# EAGLE design LaserCutterControlSimple (EAGLE 7.1.0)
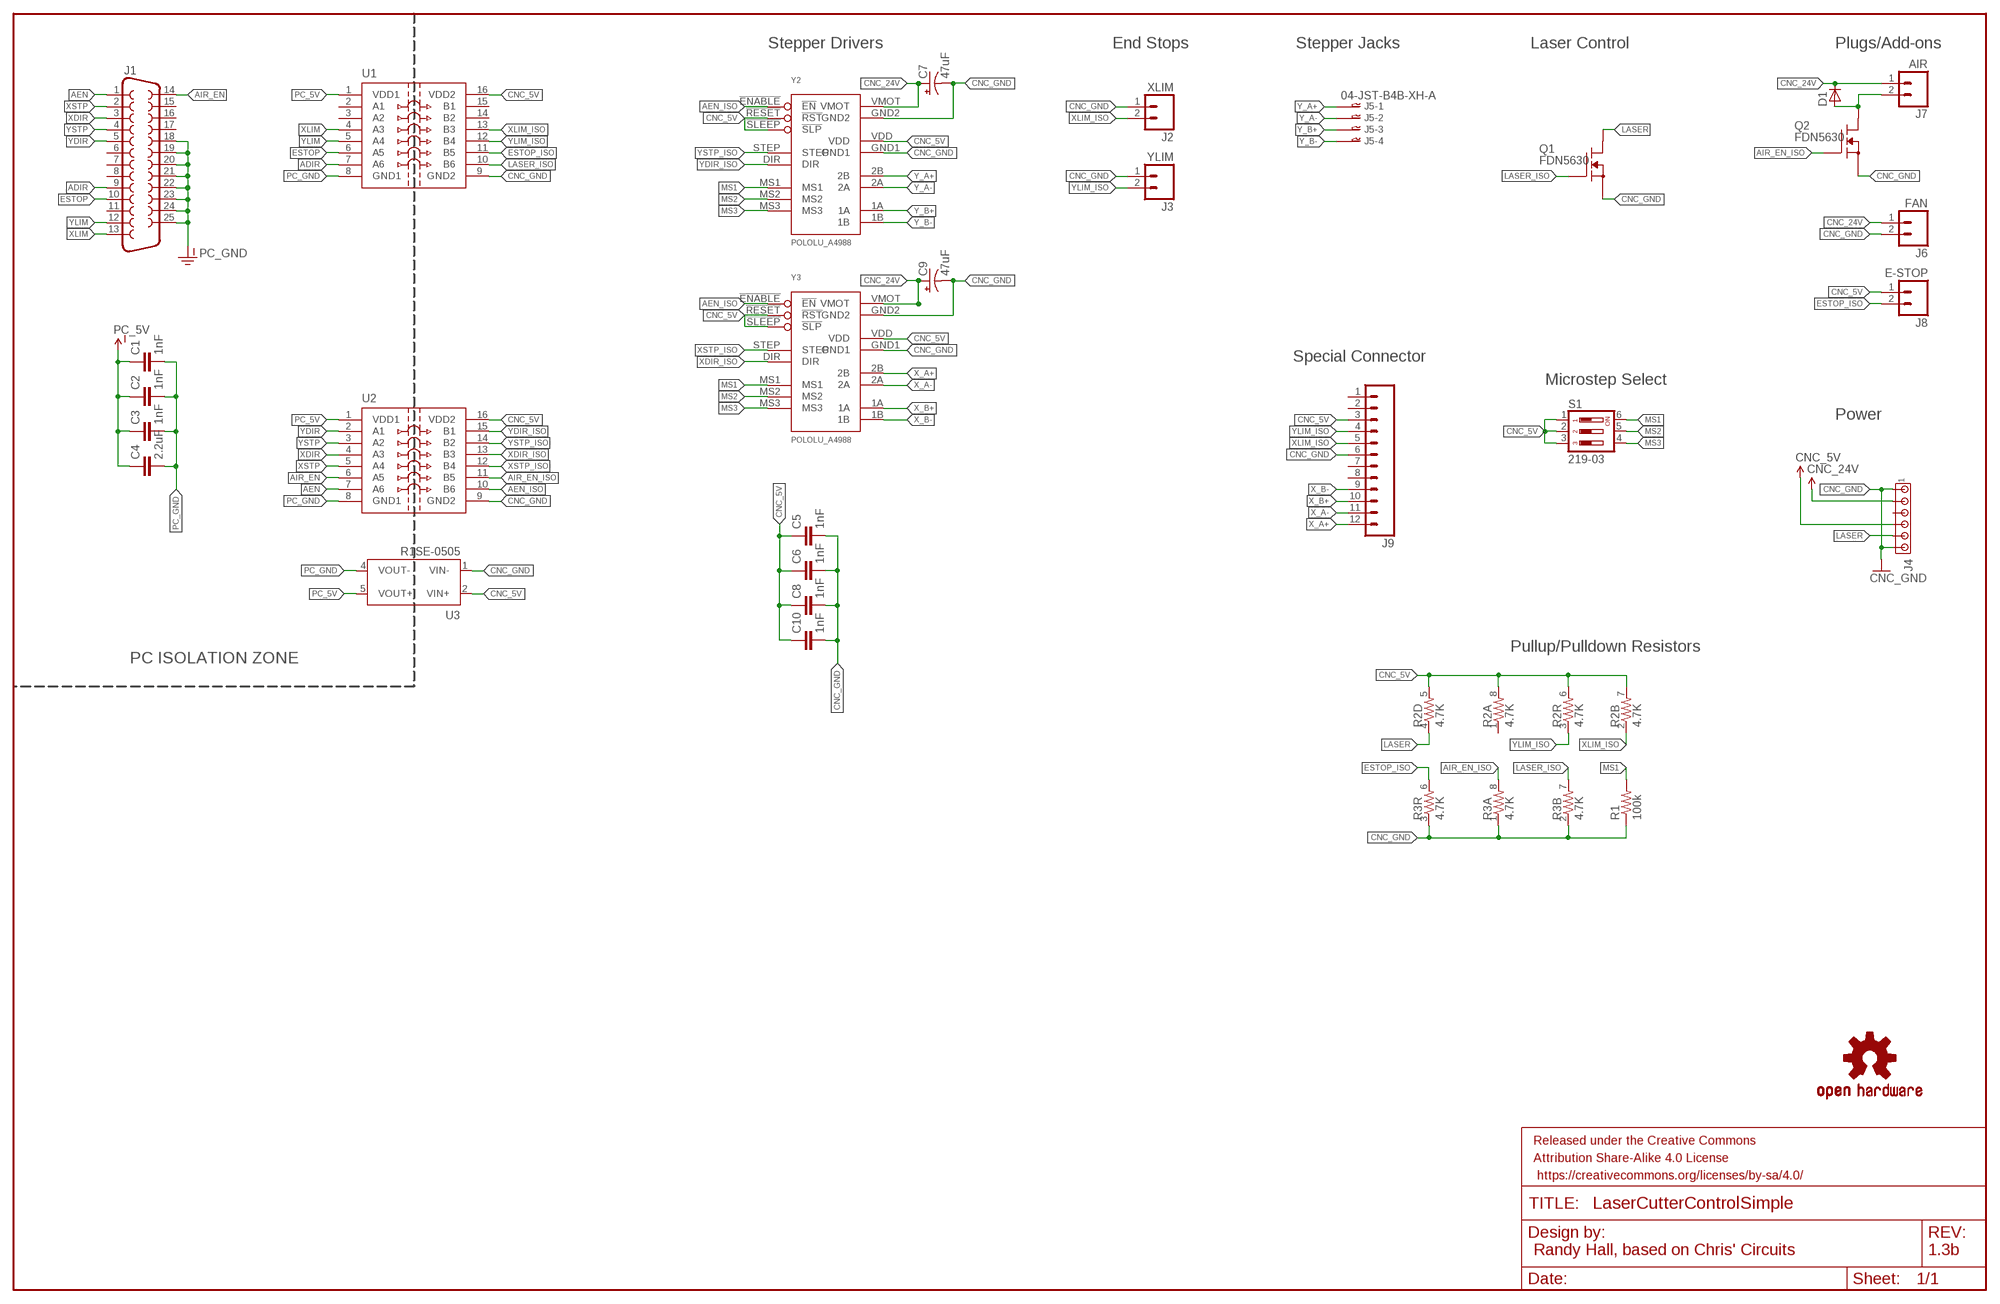
[diagram p0: schematic, sheet 1]

## Parts
C1  1nF  1NF/1000PF-50V-10%(0603)  [0603-CAP]
C2  1nF  1NF/1000PF-50V-10%(0603)  [0603-CAP]
C3  1nF  1NF/1000PF-50V-10%(0603)  [0603-CAP]
C4  2.2uF  1NF/1000PF-50V-10%(0603)  [0603-CAP]
C5  1nF  1NF/1000PF-50V-10%(0603)  [0603-CAP]
C6  1nF  1NF/1000PF-50V-10%(0603)  [0603-CAP]
C7  47uF  CPOL-USE  [PANASONIC_E]
C8  1nF  1NF/1000PF-50V-10%(0603)  [0603-CAP]
C9  47uF  CPOL-USE  [PANASONIC_E]
C10  1nF  1NF/1000PF-50V-10%(0603)  [0603-CAP]
D1  D-SOD123  [SOD123]
FRAME1  FRAME-LEDGER  [CREATIVE_COMMONS]
J1  F25HP  [F25HP]
J2  XLIM  M02PTH  [1X02]
J3  YLIM  M02PTH  [1X02]
J4  MTA06-156  [1X6MTA]
J5  04-JST-B4B-XH-A  [B4B-XH]
J6  FAN  M02PTH  [1X02]
J7  AIR  M02PTH  [1X02]
J8  E-STOP  M02PTH  [1X02]
J9  M12  [12P]
LOGO1  OSHW-LOGOM  [OSHW-LOGO-M]
Q1  FDN5630  [SOT23]
Q2  FDN5630  [SOT23]
R1  100k  100KOHM1/10W1%(0603)  [0603-RES]
R2  4.7K  RESISTOR-ARRAY0603-ARV  [0603-ARV]
R3  4.7K  RESISTOR-ARRAY0603-ARV  [0603-ARV]
S1  219-03  [CTS-219-03]
U1  SI8460IS1  [SO16]
U2  SI8460IS1  [SO16]
U3  R1SE-0505  [SMD5]
Y2  POLOLU_A4988  [POLOLU_STEPPER_DRIVER]
Y3  POLOLU_A4988  [POLOLU_STEPPER_DRIVER]

## Nets
ADIR: J1.9 U1.7(A6)
AEN: J1.1 U2.7(A6)
AEN_ISO: U2.10(B6) Y2.!ENABLE(!EN) Y3.!ENABLE(!EN)
AIR_EN: J1.14 U2.6(A5)
AIR_EN_ISO: Q2.1(G) R3.8 U2.11(B5)
CNC_5V: C5.1 C6.1 C8.1 C10.1 J4.4 J8.1 J9.3 R2.5 R2.6 R2.7 R2.8 S1.1 S1.2 S1.3 U1.16(VDD2) U2.16(VDD2) U3.2(VIN+) Y2.!RESET(!RST) Y2.!SLEEP(!SLP) Y2.VDD Y3.!RESET(!RST) Y3.!SLEEP(!SLP) Y3.VDD
CNC_24V: C7.+ C9.+ D1.1(C) J4.2 J6.1 J7.1 Y2.VMOT Y3.VMOT
CNC_GND: C5.2 C6.2 C7.- C8.2 C9.- C10.2 J2.1 J3.1 J4.1 J4.6 J6.2 J9.6 Q1.2(S) Q2.2(S) R1.1 R3.1 R3.2 R3.3 U1.9(GND2) U2.9(GND2) U3.1(VIN-) Y2.GND1 Y2.GND2 Y3.GND1 Y3.GND2
ESTOP: J1.10 U1.6(A5)
ESTOP_ISO: J8.2 R3.6 U1.11(B5)
LASER: J4.5 Q1.3(D) R2.4
LASER_ISO: Q1.1(G) R3.7 U1.10(B6)
MS1: R1.2 S1.6 Y2.MS1 Y3.MS1
MS2: S1.5 Y2.MS2 Y3.MS2
MS3: S1.4 Y2.MS3 Y3.MS3
N$8: D1.2(A) J7.2 Q2.3(D)
PC_5V: C1.1 C2.1 C3.1 C4.1 U1.1(VDD1) U2.1(VDD1) U3.5(VOUT+)
PC_GND: C1.2 C2.2 C3.2 C4.2 J1.18 J1.19 J1.20 J1.21 J1.22 J1.23 J1.24 J1.25 U1.8(GND1) U2.8(GND1) U3.4(VOUT-)
X_A+: J9.12 Y3.2B
X_A-: J9.11 Y3.2A
X_B+: J9.10 Y3.1A
X_B-: J9.9 Y3.1B
XDIR: J1.3 U2.4(A3)
XDIR_ISO: U2.13(B3) Y3.DIR
XLIM: J1.13 U1.4(A3)
XLIM_ISO: J2.2 J9.5 R2.2 U1.13(B3)
XSTP: J1.2 U2.5(A4)
XSTP_ISO: U2.12(B4) Y3.STEP
Y_A+: J5.P$1 Y2.2B
Y_A-: J5.P$2 Y2.2A
Y_B+: J5.P$3 Y2.1A
Y_B-: J5.P$4 Y2.1B
YDIR: J1.5 U2.2(A1)
YDIR_ISO: U2.15(B1) Y2.DIR
YLIM: J1.12 U1.5(A4)
YLIM_ISO: J3.2 J9.4 R2.3 U1.12(B4)
YSTP: J1.4 U2.3(A2)
YSTP_ISO: U2.14(B2) Y2.STEP
Unconnected: J1.6 J1.7 J1.8 J1.11 J1.15 J1.16 J1.17 J4.3 J9.1 J9.2 J9.7 J9.8 R2.1 R3.4 R3.5 U1.2(A1) U1.3(A2) U1.14(B2) U1.15(B1)

## Notes on the sheet
- Stepper Drivers | End Stops | Stepper Jacks | Laser Control | Plugs/Add-ons
- Special Connector
- Microstep Select
- Power
- Pullup/Pulldown Resistors
- PC ISOLATION ZONE
- Randy Hall, based on Chris' Circuits | 1.3b

## Library data of the parts
C1-C3 C5 C6 C8 C10 = SparkFun-Capacitors:1NF/1000PF-50V-10%(0603): CAP-07886; PROD_ID: CAP-07886
C4 = SparkFun-Capacitors:1NF/1000PF-50V-10%(0603): CAP-07886; PROD_ID: CAP-07886; VALUE: 1nF
C7 C9 = rcl:CPOL-US: POLARIZED CAPACITOR, American symbol
D1 = semicon-smd-ipc:D-: DIODE unfilled
FRAME1 = SparkFun-Aesthetics:FRAME-LEDGER: Schematic Frame Standard 11x14 US Ledger frame
J1 = SparkFun-Connectors:F25: 25 Pin male connector. PCB edge mount for regular PCB thicknesses. This connector will connect directly to the back of a PC parallel port or through a normal DB25 extension cable (M/F). SKU: PRT-08287
J2 J3 J6-J8 = SparkFun-Connectors:M02: Standard 2-pin 0.1" header. Use with - straight break away headers ( PRT-00116) - right angle break away headers (PRT-00553) - swiss pins (PRT-00743) - machine pins (PRT-00117) - female headers (PRT-00115) Molex polarized connector foot print use with: PRT-08233 with associated crimp pins and housings. 2.54_SCREWTERM for use with PRT-10571. 3.5mm Screw Terminal footprints for PRT-08084 5mm Screw Terminal footprints for use with PRT-08433
J4 = con-amp:MTA06-156: AMP connector
J5 = con-jst-xh:04-JST: JST CONNECTOR
J9 = con-amp-te:M12: TE CONNECTIVITY FFC/FPC CONNECTOR 12P Used for FFC/FPC connections.; OC_FARNELL: unknown; OC_NEWARK: unknown
LOGO1 = SparkFun-Aesthetics:OSHW-LOGO: Open Source Hardware Logo This logo indicates the piece of hardware it is found on incorporates a OSHW license and/or adheres to the definition of open source hardware found here: http://freedomdefined.org/OSHW
Q1 Q2 = Fairchild_By_element14_Batch_1:FDN5630
R1 = SparkFun-Resistors:100KOHM1/10W1%(0603): RES-07828; PROD_ID: RES-07828
R2 R3 = SparkFun-Resistors:RESISTOR-ARRAY: Array Chip Resistor Source: RS Component / Phycomp
S1 = switch-dil:219-03*: Surface Mount DIP Switch Series 219 SMT CTS Electronic Components Sourc: www.ctscorp.com; OC_FARNELL: unknown; OC_NEWARK: unknown
U1 U2 = silicon-labs:SI8460: Si8460 6 Channel (6/0) Digital Isolator Silicon Labs Si84xx ISOpro digital isolator series. The Si84xx ISOpro digital isolators provide low power galvanic isolation for digital signals. They come in speeds of 1Mbps and 150Mbps, and isolation ratings of 1KV, 2.5KV and 5KV. The independent sides use 2.7-5.5V supplies and draw under 5mA per channel. Donald Becker
U3 = recom-international:R1S; MOUSER_PN: 919-R1SE-0505
Y2 Y3 = pololu:POLOLU_A4988

## Board
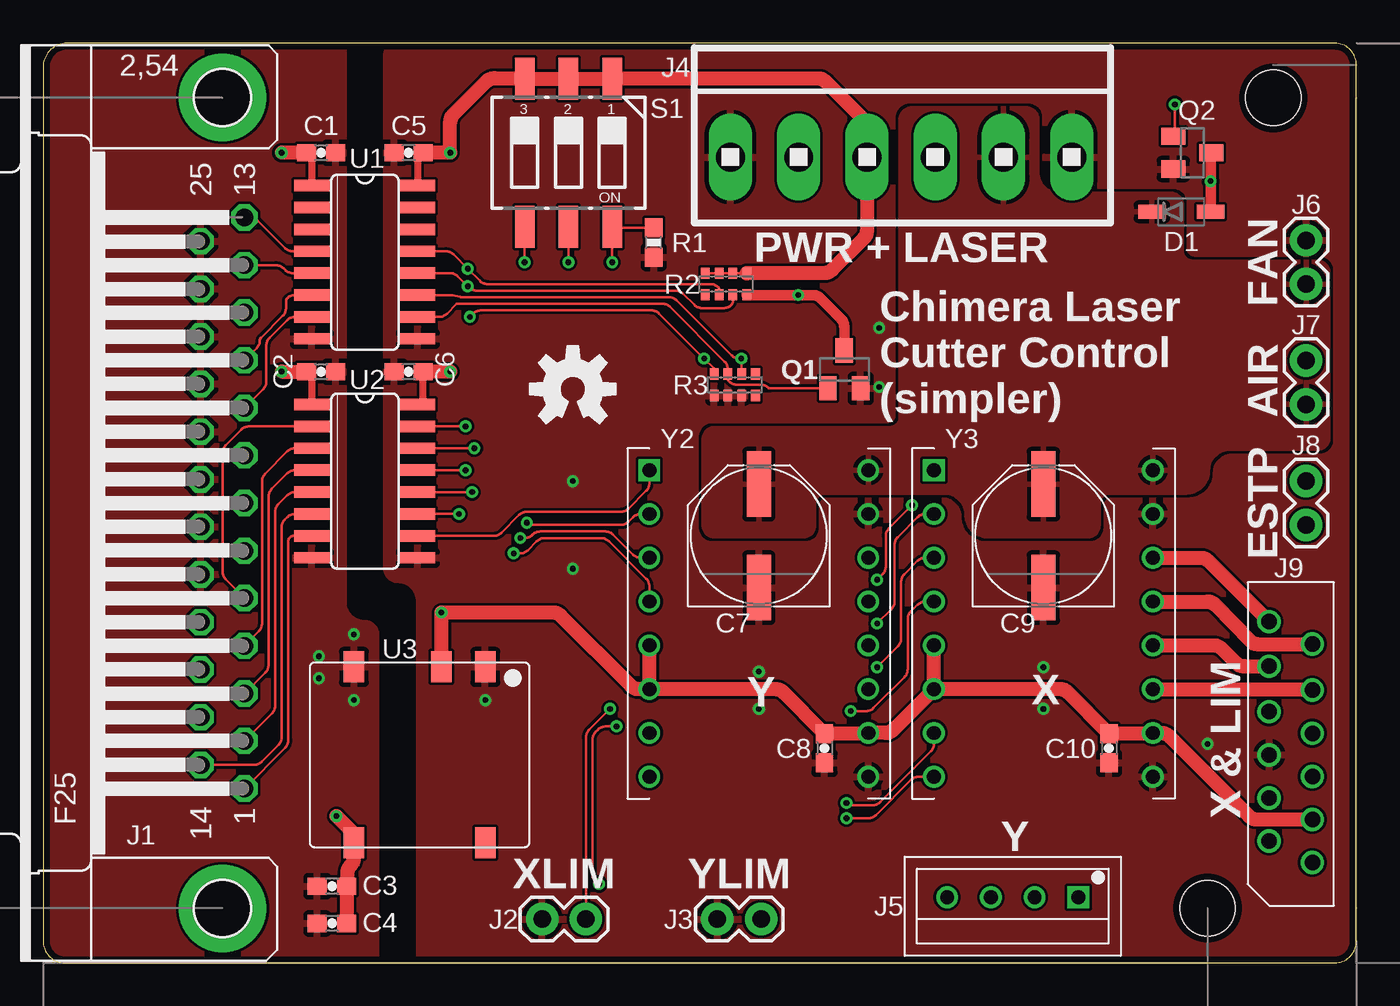
[diagram p1: board, top side]
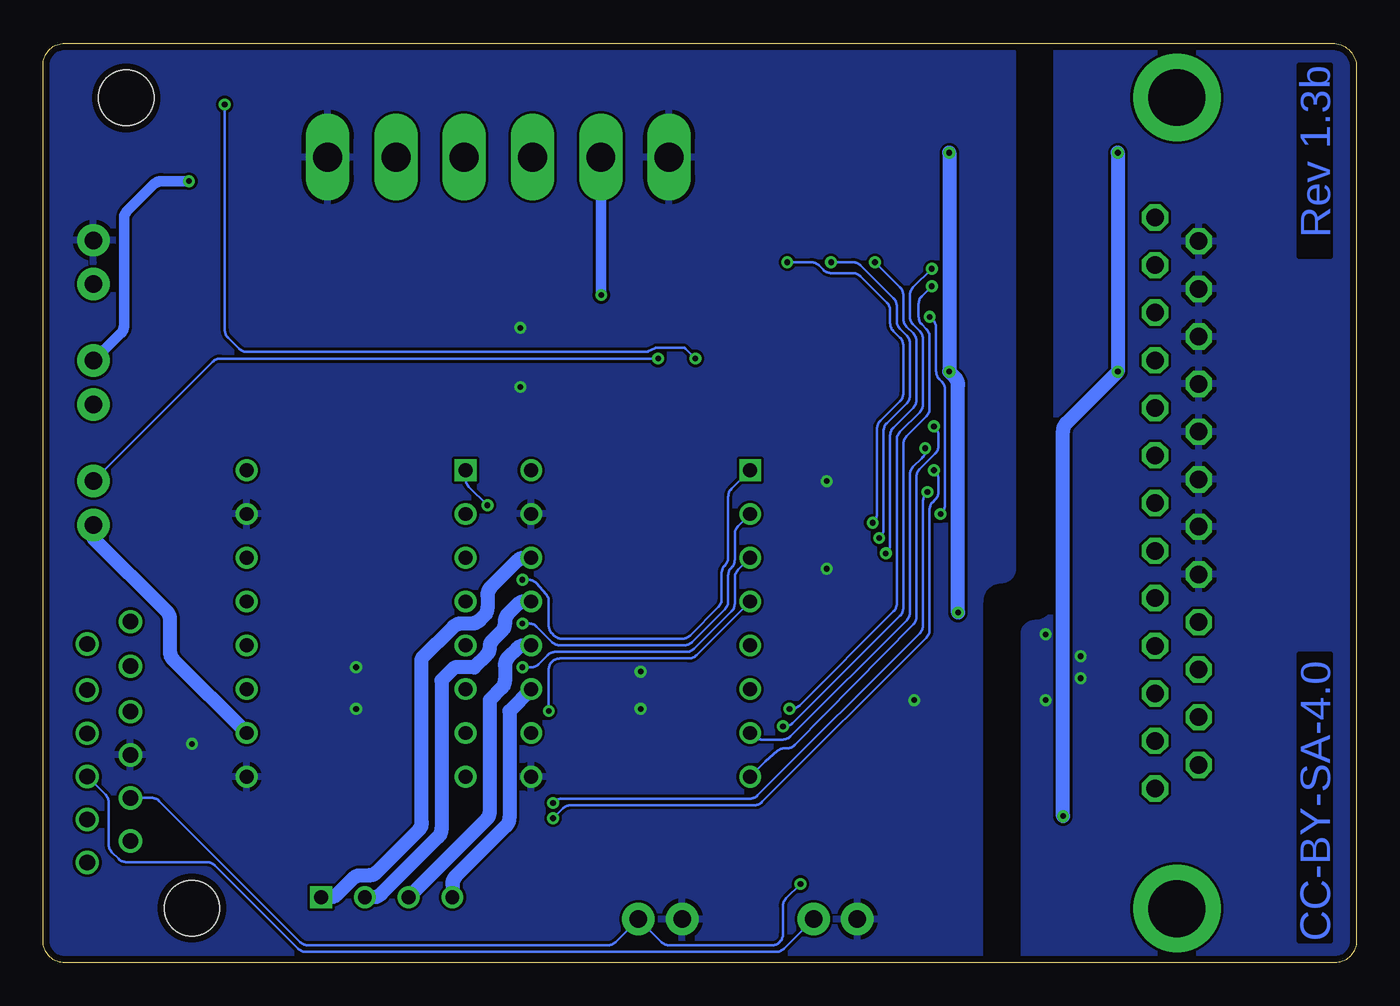
[diagram p2: board, bottom side, seen from below]

Size 76.2 x 53.35 mm. Coordinates in mm from the lower left corner, seen from the top.
Outline: 74.93,53.34 1.52,53.34 arc90 0,52.07 0,1.27 arc90 1.27,0 74.93,0 arc90 76.2,1.27 76.2,52.07 arc90 74.93,53.34
Copper layers (1*16): Top 0.0356mm / dielectric 1.5011mm / Bottom 0.0356mm
Design rules "OSHPark *": minimum track width 6mil, minimum drill 13mil, track to track 6mil, track to pad 6mil, pad to pad 6mil, via to via 6mil, smd to smd 6mil, copper to edge 15mil, drill to drill 6mil, minimum pad ring 9mil, minimum via ring 7mil, stop-mask expansion 3mil, vias tented up to drill 20mil, thermal gap 10mil
Holes 3.2 mm at 71.37,50.16 67.56,3.17

### Footprints (pad centres in the part's own frame; a part is rotated, then mirrored left to right if it is on the bottom)
0603-CAP = smd 1.1 x 1: 1 -0.85,0; 2 0.85,0
PANASONIC_E = smd 3.8 x 1.4: + 3,0; - -3,0
SOD123 = smd 1.6 x 0.8: 1 -1.7,0; 2 1.7,0
F25HP = drill 1.016 octagon: 1 -16.561,-1.27; 2 -13.792,-1.27; 3 -11.049,-1.27; 4 -8.28,-1.27; 5 -5.512,-1.27; 6 -2.769,-1.27; 7 0,-1.27; 8 2.769,-1.27; 9 5.512,-1.27; 10 8.28,-1.27; 11 11.049,-1.27; 12 13.792,-1.27; 13 16.561,-1.27; 14 -15.189,1.27; 15 -12.421,1.27; 16 -9.652,1.27; 17 -6.909,1.27; 18 -4.14,1.27; 19 -1.372,1.27; 20 1.372,1.27; 21 4.14,1.27; 22 6.909,1.27; 23 9.652,1.27; 24 12.421,1.27; 25 15.189,1.27 | drill 3.302 pad 5.08: G1 -23.52,0; G2 23.52,0
1X02 = drill 1.016 pad 1.88: 1 0,0; 2 2.54,0
1X6MTA = drill 1.676 long: 1 9.906,0; 2 5.944,0; 3 1.981,0; 4 -1.981,0; 5 -5.944,0; 6 -9.906,0
B4B-XH = drill 0.8 square: P$1 -3.81,0 | drill 0.8: P$2 -1.27,0; P$3 1.27,0; P$4 3.81,0
12P = drill 0.9: 1 -6.25,-1.25; 2 -5,1.25; 3 -3.75,-1.25; 4 -2.5,1.25; 5 -1.25,-1.25; 6 0,1.25; 7 1.25,-1.25; 8 2.5,1.25; 9 3.75,-1.25; 10 5.14,1.25; 11 6.43,-1.25; 12 7.72,1.25
SOT23 = smd 1 x 1.4: 1 -0.95,-1.1; 2 0.95,-1.1; 3 0,1.1
0603-RES = smd 1.1 x 1: 1 -0.85,0; 2 0.85,0
0603-ARV = smd 0.5 x 0.65: 1 -1.2,-0.625; 2 -0.4,-0.625; 3 0.4,-0.625; 4 1.2,-0.625; 5 1.2,0.625; 6 0.4,0.625; 7 -0.4,0.625; 8 -1.2,0.625
CTS-219-03 = smd 1.13 x 2.44: 1 -2.54,-4.3; 2 0,-4.3; 3 2.54,-4.3; 4 2.54,4.3; 5 0,4.3; 6 -2.54,4.3
SO16 = smd 0.66 x 2.032: 1 -4.445,-3.073; 2 -3.175,-3.073; 3 -1.905,-3.073; 4 -0.635,-3.073; 5 0.635,-3.073; 6 1.905,-3.073; 7 3.175,-3.073; 8 4.445,-3.073; 9 4.445,3.073; 10 3.175,3.073; 11 1.905,3.073; 12 0.635,3.073; 13 -0.635,3.073; 14 -1.905,3.073; 15 -3.175,3.073; 16 -4.445,3.073
SMD5 = smd 1.2 x 1.8: 1 -3.81,-5.1; 2 -1.27,-5.1; 4 3.81,-5.1; 5 3.81,5.1; 8 -3.81,5.1
POLOLU_STEPPER_DRIVER = drill 0.8: 1A 6.35,-1.27; 1B 6.35,-3.81; 2A 6.35,1.27; 2B 6.35,3.81; !RESET -6.35,-1.27; !SLEEP -6.35,-3.81; DIR -6.35,-8.89; GND1 6.35,-8.89; GND2 6.35,6.35; MS1 -6.35,6.35; MS2 -6.35,3.81; MS3 -6.35,1.27; STEP -6.35,-6.35; VDD 6.35,-6.35; VMOT 6.35,8.89 | drill 0.8 square: !ENABLE -6.35,8.89

### Placement (x,y rotation side)
C1  16.13,46.99 0 top
C2  16.13,34.29 0 top
C3  16.76,4.45 180 top
C4  16.76,2.29 180 top
C5  21.21,46.99 180 top
C6  21.21,34.29 180 top
C7  41.53,24.77 90 top
C8  45.34,12.45 270 top
C9  58.04,24.77 90 top
C10  61.85,12.45 270 top
D1  66.04,43.56 0 top
FRAME1  14.22,55.88 0 top
J1  10.41,26.67 90 top
J2  28.96,2.54 0 top
J3  39.12,2.54 0 top
J4  49.78,46.74 0 top
J5  56.26,3.81 180 top
J6  73.28,39.37 90 top
J7  73.28,32.38 90 top
J8  73.28,25.4 90 top
J9  72.39,12.06 90 top
LOGO1  30.73,33.27 0 top
Q1  46.48,34.42 0 top
Q2  66.67,46.99 270 top
R1  35.43,41.78 90 top
R2  39.62,39.37 0 top
R3  40.13,33.53 0 top
S1  30.48,46.99 180 top
U1  18.67,40.64 270 top
U2  18.67,27.94 270 top
U3  21.84,12.06 180 top
Y2  41.53,19.68 0 top
Y3  58.04,19.68 0 top

### Tracks (layer width: path | path; a pad name or v marks a point on that pad's centre or on a via)
ADIR
  Top 0.152: J1.9 12.77,33.27 arc45 12.95,33.72 12.95,35.8 arc-45 13.14,36.25 14.16,37.28 arc-45 14.61,37.47 U1.7
AEN
  Top 0.152: J1.1 14.04,12.46 arc45 14.22,12.91 14.22,24.45 arc-90 14.54,24.77 U2.7
AEN_ISO  (via drill 0.33)
  Top 0.152: U2.10 26.15,24.77 arc45 26.6,24.95 27.63,25.98 arc-45 28.08,26.16 33.52,26.16 arc45 33.97,26.35 34.99,27.37 arc45 35.18,27.82 Y2.!ENABLE | v50.42,26.54 49.08,25.2 arc45 48.9,24.76 48.9,23 arc-45 48.71,22.55 v48.39,22.23
  Bottom 0.152: v50.42,26.54 51.5,27.63 arc45 51.69,28.08 Y3.!ENABLE | v48.39,22.23 48.04,22.23 arc49 47.56,22.01 47.02,21.39 arc41 46.86,20.97 46.86,19.57 arc-45 46.68,19.12 46.54,18.98 arc-45 46.09,18.8 39.12,18.8 arc-45 38.68,18.98 37.02,20.64 arc-45 36.83,21.09 36.83,22.6 arc45 36.64,23.05 36.63,23.05 arc-45 36.45,23.5 36.45,27.04 arc45 36.26,27.49 Y2.!ENABLE
AIR_EN
  Top 0.152: J1.14 12.23,11.48 arc45 12.68,11.67 13.66,12.64 arc45 13.84,13.09 13.84,25.26 arc-45 14.03,25.71 14.16,25.85 arc-45 14.61,26.04 U2.6
AIR_EN_ISO  (via drill 0.33)
  Top 0.152: U2.11 v24.13,26.04 | v24.77,37.47 24.96,37.66 arc-45 25.41,37.85 35.3,37.85 arc-45 35.75,37.66 v38.35,35.05 38.93,34.47 R3.8 | v65.66,49.78 65.66,48.02 Q2.1
  Bottom 0.152: v24.13,26.04 24.06,26.1 arc-45 23.88,26.55 23.88,33.27 arc-45 24.06,33.71 24.2,33.85 arc45 24.38,34.3 24.38,36.82 arc-45 24.57,37.27 v24.77,37.47 | v38.35,35.05 38.91,35.61 arc-45 39.09,35.69 40.58,35.69 arc-27 40.69,35.66 41.09,35.46 arc27 41.21,35.43 64.38,35.43 arc45 64.83,35.62 65.47,36.26 arc45 65.66,36.71 v65.66,49.78
CNC_5V  (via drill 0.33)
  Top 0.152: R2.5 R2.6 R2.7 R2.8
  Top 0.406: C5.1 21.74,46.67 U1.16 | 21.74,33.97 C6.1 22.06,32.7 U2.16 | 27.92,51.31 S1.3
  Top 0.813: U3.2 v23.11,20.32 29.58,20.32 arc-45 30.03,20.13 34.1,16.06 arc45 34.55,15.88 Y2.!SLEEP | C5.1 v23.62,46.99 23.62,48.76 arc-45 23.81,49.21 25.72,51.12 arc-45 26.17,51.31 27.92,51.31 | v23.62,34.29 C6.1 | S1.3 S1.2 S1.1 44.97,51.29 arc-45 45.42,51.1 47.62,48.9 arc-45 47.8,48.45 J4.4 47.8,42.48 arc-45 47.62,42.03 45.78,40.19 arc-45 45.33,40.01 40.83,40.01 R2.5 | Y2.!SLEEP 42.5,15.88 arc-45 42.95,15.69 C8.1 47.84,13.3 Y2.VDD 48.89,13.34 arc45 49.34,13.52 Y3.!SLEEP | 61.89,13.34 C10.1 | C10.1 59.46,15.69 arc45 59.01,15.88 Y3.!SLEEP | Y3.!SLEEP Y3.!RESET | Y2.!SLEEP Y2.!RESET | C10.1 64.35,13.3 Y3.VDD 64.89,13.34 arc-45 65.34,13.15 69.98,8.5 arc45 70.43,8.31 J9.3
  Bottom 0.813: v23.11,20.32 23.11,33.52 arc-45 23.3,33.97 v23.62,34.29 v23.62,46.99 | Y3.VDD 68.65,17.59 arc45 68.83,18.04 68.83,19.93 arc-45 69.02,20.38 73.28,24.64 J8.1
CNC_24V
  pour Top: 38.35,25.4 38.35,30.35 arc-90 38.99,30.99 49.15,30.99 arc90 49.78,31.62 49.78,48.9 arc-90 50.42,49.53 57.02,49.53 arc-90 57.66,48.9 57.66,45.85 arc90 58.93,44.58 65.41,44.58 arc-90 66.04,43.94 66.04,41.27 arc90 66.67,40.64 73.91,40.64 arc-90 74.55,40.01 74.55,30.48 arc-90 73.91,29.84 68.83,29.84 arc90 67.56,28.57 arc-90 66.29,27.3 61.85,27.3 arc90 61.21,26.67 61.21,25.4 arc-90 60.58,24.77 54.86,24.77 arc-90 53.59,26.04 arc90 52.32,27.3 45.34,27.3 arc90 44.7,26.67 44.7,25.4 arc-90 44.07,24.77 38.99,24.77 arc-90
CNC_GND  (via drill 0.33)
  other vias: 48.51,33.4 48.51,36.83 30.73,27.94 30.73,22.86 25.65,15.24 67.56,12.7 41.53,16.89 41.53,14.73 58.04,17.14 58.04,14.73
  pour Top (rank 6): 21.84,0 21.84,20.95 arc90 20.57,22.23 arc-90 19.94,22.86 19.94,52.7 arc-90 20.57,53.34 76.45,53.34 76.45,0
  pour Bottom (rank 6): 19.94,22.86 19.94,52.7 arc-90 20.57,53.34 75.82,53.34 75.82,0 21.84,0 21.84,20.95 arc90 20.57,22.23 arc-90
ESTOP
  Top 0.152: J1.10 12.39,35.65 arc45 12.57,36.1 arc-45 12.64,36.26 13.91,37.53 arc45 14.1,37.98 14.1,38.38 arc-45 14.16,38.55 arc-45 14.61,38.73 U1.6
ESTOP_ISO  (via drill 0.33)
  Top 0.152: U1.11 23.62,38.73 arc-13 23.77,38.72 24.19,38.62 arc13 24.33,38.61 36.31,38.61 arc-45 36.76,38.42 39.95,35.24 arc45 40.4,35.05 v40.51,35.05 arc-45 40.53,35.01 R3.6
  Bottom 0.152: J8.2 66.35,34.87 arc45 65.9,35.05 v40.51,35.05
LASER  (via drill 0.33)
  Top 0.61: R2.4 40.83,38.73 v43.81,38.73 44.65,38.73 arc-45 45.1,38.55 46.3,37.35 arc-45 46.48,36.91 Q1.3
  Bottom 0.61: v43.81,38.73 43.84,38.76 J4.5
LASER_ISO
  Top 0.152: U1.10 22.98,37.47 arc45 23.43,37.65 24,38.23 35.93,38.23 arc-45 36.38,38.04 39.55,34.88 arc-45 39.73,34.43 R3.7 39.73,33.8 39.82,33.71 arc45 40.27,33.53 41.65,33.53 arc-45 42.1,33.34 arc45 42.16,33.32 Q1.1
MS1  (via drill 0.33)
  Top 0.152: v33.02,40.64 S1.6 33.08,42.63 R1.2 | Y2.MS1 34.68,26.04 arc45 34.23,25.85 33.97,25.59 arc-45 33.52,25.4 28.37,25.4 arc-45 v28.07,25.53 | Y3.MS1 51.19,26.04 arc45 50.74,25.85 49.59,24.7 arc45 49.4,24.25 49.4,20.96 arc-45 49.22,20.52 v48.39,19.68
  Bottom 0.152: v33.02,40.64 31.63,40.64 arc45 31.18,40.45 30.92,40.19 arc-45 30.47,40.01 29.22,40.01 arc45 28.77,39.82 27.24,38.29 arc45 27.05,37.84 27.05,37.09 arc-45 26.86,36.64 26.48,36.25 arc45 26.29,35.8 26.29,33.03 arc45 26.48,32.58 27.63,31.43 arc-45 27.81,30.98 27.81,26.04 arc45 28,25.59 v28.07,25.53 | v48.39,19.68 48.02,19.68 arc45 47.57,19.5 46.67,18.6 arc-45 46.22,18.41 39,18.41 arc-45 38.55,18.6 36.63,20.52 arc-45 36.45,20.96 36.45,22.47 arc45 36.26,22.92 36.25,22.93 arc-45 36.07,23.38 36.07,24.88 arc45 35.88,25.33 Y2.MS1
MS2  (via drill 0.33)
  Top 0.152: S1.5 v30.48,40.64 | Y2.MS2 34.68,23.5 arc-45 34.23,23.68 33.08,24.83 arc45 32.63,25.02 28.84,25.02 arc45 28.39,24.83 28.38,24.82 arc-45 27.93,24.64 v27.69,24.64 | Y3.MS2 51.19,23.5 arc45 50.74,23.31 49.97,22.54 arc45 49.78,22.09 49.78,18.8 arc-45 49.6,18.36 v48.39,17.14
  Bottom 0.152: v30.48,40.64 29.22,40.64 arc45 28.77,40.45 26.86,38.54 arc45 26.67,38.09 26.67,37.22 arc-45 26.48,36.77 26.09,36.38 arc45 25.91,35.93 25.91,32.9 arc45 26.09,32.45 27.25,31.3 arc-45 27.43,30.85 27.43,25.16 arc45 27.62,24.71 v27.69,24.64 | v48.39,17.14 47.89,17.14 arc-45 47.44,17.33 46.92,17.85 arc45 46.47,18.03 38.87,18.03 arc-45 38.42,18.22 36.25,20.39 arc-45 36.07,20.84 36.07,22.34 arc45 35.88,22.79 Y2.MS2
MS3  (via drill 0.33)
  Top 0.152: S1.4 v27.94,40.64 | Y2.MS3 35.18,21.84 arc45 34.99,22.28 32.83,24.45 arc45 32.38,24.64 29.09,24.64 arc45 28.64,24.45 28.13,23.93 arc-45 27.68,23.75 v27.3,23.75 | v46.86,14.61 47.74,14.61 arc45 48.19,14.79 49.98,16.58 arc45 50.16,17.03 50.16,19.93 arc-45 50.35,20.38 50.74,20.77 arc-45 51.19,20.95 Y3.MS3
  Bottom 0.152: v27.94,40.64 26.48,39.17 arc45 26.29,38.73 26.29,37.35 arc-45 26.1,36.9 25.71,36.51 arc45 25.53,36.06 25.53,32.65 arc45 25.71,32.2 26.86,31.05 arc-45 27.05,30.6 27.05,24.27 arc45 27.24,23.82 v27.3,23.75 | v46.86,14.61 46.86,17.01 arc45 46.68,17.46 46.67,17.47 arc45 46.22,17.65 38.74,17.65 arc-45 38.3,17.84 Y2.MS3
N$8  (via drill 0.33)
  Top 0.61: Q2.3 67.74,46.95 v67.74,45.34 D1.2
  Bottom 0.61: J7.2 71.69,36.52 arc-45 71.5,36.97 71.5,43.17 arc45 71.31,43.62 69.78,45.15 arc45 69.33,45.34 v67.74,45.34
PC_5V  (via drill 0.33)
  Top 0.406: C1.1 15.6,46.67 U1.1 | C2.1 15.6,33.97 U2.1
  Top 0.813: C4.1 C3.1 17.65,4.48 17.65,5.2 arc-45 17.84,5.65 17.85,5.66 arc45 18.03,6.11 U3.5 18.03,7.49 v17.02,8.51 | v13.84,34.29 C2.1 | C1.1 v13.84,46.99
  Bottom 0.813: v17.02,8.51 17.02,30.85 arc45 16.83,31.3 v13.84,34.29 v13.84,46.99
PC_GND  (via drill 0.33)
  other vias: 18.03,19.05 16,17.78 16,16.51 18.03,15.24
  pour Top: 0,53.34 17.4,53.34 17.4,20.95 arc90 18.67,19.68 arc-90 19.3,19.05 19.3,0 0,0
  pour Bottom: 0,53.34 17.4,53.34 17.4,20.95 arc90 18.67,19.68 arc-90 19.3,19.05 19.3,0 0,0
X_A+
  Top 0.813: Y3.2B 67.17,23.5 arc-45 67.62,23.31 J9.12
X_A-
  Top 0.813: Y3.2A 67.55,20.95 arc-46 68,20.76 70.04,18.67 arc46 70.5,18.48 73.59,18.48 J9.11
X_B+
  Top 0.813: Y3.1A 67.94,18.41 arc-45 68.39,18.23 69.22,17.39 arc45 69.67,17.2 J9.10
X_B-
  Top 0.813: Y3.1B 73.58,15.88 J9.9
XDIR
  Top 0.152: J1.3 12.89,16.83 arc45 13.08,17.28 13.08,27.04 arc-45 13.27,27.49 14.16,28.39 arc-45 14.61,28.57 U2.4
XDIR_ISO  (via drill 0.33)
  Top 0.152: U2.13 v24.51,28.57 | v46.61,8.38 47.87,8.38 arc45 48.32,8.57 50.36,10.61 arc-45 50.81,10.79 Y3.DIR
  Bottom 0.152: v46.61,8.38 46.03,8.96 arc45 45.58,9.14 34.93,9.14 arc-45 34.48,9.33 24.95,18.86 arc-45 24.77,19.31 24.77,26.28 arc45 24.58,26.73 24.44,26.86 arc-45 24.26,27.31 24.26,28.06 arc-45 24.44,28.51 v24.51,28.57
XLIM
  Top 0.152: J1.13 12.01,43.23 arc-45 12.45,43.05 14.04,41.46 arc45 14.49,41.27 U1.4
XLIM_ISO  (via drill 0.33)
  Top 0.152: U1.13 23.36,41.27 arc-45 23.81,41.09 v24.64,40.26 25.34,39.56 arc45 25.79,39.37 38.73,39.37 arc-45 39.17,39.18 39.22,39.13 R2.2 | v32.89,14.73 31.68,13.52 arc45 31.5,13.07 J2.2
  Bottom 0.152: v32.89,14.73 32.77,14.73 arc-45 32.33,14.92 26.86,20.39 arc-45 26.67,20.84 26.67,30.34 arc45 26.48,30.79 25.33,31.95 arc-45 25.15,32.39 25.15,36.19 arc-45 25.33,36.63 25.72,37.02 arc45 25.91,37.47 25.91,38.73 arc45 25.72,39.17 v24.64,40.26 | J2.2 33.22,0.82 arc45 33.66,0.64 60.95,0.64 arc45 61.4,0.82 66.23,5.66 arc-45 66.68,5.84 71.36,5.84 arc45 71.81,6.03 72.2,6.42 arc45 72.39,6.87 72.39,9.3 arc-45 72.58,9.75 J9.5
XSTP
  Top 0.152: J1.2 13.28,14.47 arc45 13.46,14.92 13.46,26.15 arc-45 13.65,26.6 14.16,27.12 arc-45 14.61,27.3 U2.5
XSTP_ISO  (via drill 0.33)
  Top 0.152: U2.12 v24.89,27.3 | v46.61,9.27 arc45 46.92,9.14 48.12,9.14 arc45 48.57,9.33 51.5,12.26 arc45 51.69,12.71 Y3.STEP
  Bottom 0.152: v46.61,9.27 46.54,9.34 arc45 46.09,9.53 35.19,9.53 arc-45 34.74,9.71 25.33,19.12 arc-45 25.15,19.57 25.15,26.79 arc45 24.96,27.24 v24.89,27.3
Y_A+
  Bottom 0.813: Y2.2B 48.25,23.5 arc-45 48.7,23.31 50.23,21.78 arc-45 50.42,21.33 50.42,20.58 arc45 50.6,20.13 50.87,19.87 arc45 51.32,19.68 51.93,19.68 arc-45 52.38,19.5 54.23,17.65 54.23,8.14 arc45 54.41,7.69 56.84,5.27 arc45 57.29,5.08 57.78,5.08 arc-45 58.23,4.89 59.12,4 arc45 59.57,3.81 J5.P$1
Y_A-
  Bottom 0.813: Y2.2A 48.25,20.95 arc-45 48.7,20.77 49.22,20.25 arc-45 49.4,19.8 49.4,19.69 arc45 49.59,19.25 50.12,18.71 arc-45 50.29,18.3 arc45 50.48,17.85 51.18,17.14 52.32,17.14 53.09,16.38 53.09,7.76 arc45 53.27,7.31 56.58,4 arc45 57.03,3.81 J5.P$2
Y_B+
  Bottom 0.813: Y2.1A 48.25,18.41 arc-45 48.7,18.23 49.22,17.71 arc-45 49.4,17.26 49.4,16.39 arc45 49.59,15.94 50.29,15.24 50.29,8.77 arc45 50.48,8.32 J5.P$3
Y_B-
  Bottom 0.813: Y2.1B 49.15,14.61 49.15,8.39 arc45 49.34,7.94 52.27,5.01 arc-45 52.45,4.56 J5.P$4
YDIR
  Top 0.152: J1.5 10.6,22.24 arc-45 10.41,22.69 10.41,29.58 arc-45 10.6,30.03 11.5,30.93 arc-45 11.95,31.11 U2.2
YDIR_ISO  (via drill 0.33)
  Top 0.152: U2.15 v24.51,31.11
  Bottom 0.152: v24.51,31.11 24.44,31.05 arc45 24.26,30.6 24.26,29.98 arc45 24.44,29.53 25.34,28.63 arc-45 25.53,28.18 25.53,20.07 arc45 25.71,19.63 32.58,12.64 arc45 33.03,12.45 33.17,12.45 arc-41 33.58,12.29 34.29,11.68 Y2.DIR
YLIM
  Top 0.152: J1.12 13.5,40.46 arc-45 13.95,40.28 14.04,40.19 arc45 14.49,40.01 U1.5
YLIM_ISO  (via drill 0.33)
  Top 0.152: R2.3 40.02,38.37 arc-45 39.94,38.16 arc-45 39.49,37.97 38.24,37.97 arc-45 37.79,38.16 37.14,38.8 arc45 36.69,38.99 25.16,38.99 arc-45 24.71,39.17 v24.64,39.24 24.06,39.82 arc45 23.61,40.01 U1.12 | v33.27,13.72 32.65,13.72 arc45 32.2,13.53 32.06,13.39 arc45 31.88,12.95 31.88,4.95 v32.26,4.57
  Bottom 0.152: v33.27,13.72 33.16,13.72 arc-45 32.71,13.9 26.48,20.13 arc-45 26.29,20.58 26.29,30.09 arc45 26.1,30.54 24.95,31.69 arc-45 24.77,32.14 24.77,36.31 arc-45 24.95,36.76 25.21,37.02 arc45 25.4,37.47 25.4,38.22 arc45 25.21,38.67 v24.64,39.24 | v32.26,4.57 33.09,3.74 arc-45 33.27,3.29 33.27,1.65 arc90 33.91,1.02 39.87,1.02 arc45 40.32,1.2 J3.2 42.99,1.2 arc45 43.44,1.02 60.82,1.02 arc45 61.27,1.2 69.45,9.38 arc-45 69.9,9.56 J9.4
YSTP
  Top 0.152: J1.4 11.68,18.41 12.51,19.25 arc45 12.7,19.69 12.7,27.93 arc-45 12.89,28.38 14.16,29.66 arc-45 14.61,29.84 U2.3
YSTP_ISO  (via drill 0.33)
  Top 0.152: U2.14 v25.02,29.84
  Bottom 0.152: Y2.STEP 34.98,13.14 arc-45 34.53,12.95 33.28,12.95 arc-45 32.83,13.14 26.09,19.88 arc-45 25.91,20.33 25.91,28.31 arc45 25.72,28.76 25.2,29.28 arc-45 25.02,29.73 v25.02,29.84

### Text on the board
Bottom: Rev 1.3b | CC-BY-SA-4.0
tPlace: J6 | PWR + LASER | FAN | J7 | AIR | Chimera Laser / Cutter Control / (simpler) | J8 | ESTP | Y | X | X & LIM | Y
tDocu: Randy Hall